# Altium schematic sheet HCRT_STM32_Sch.SchDoc
size A4
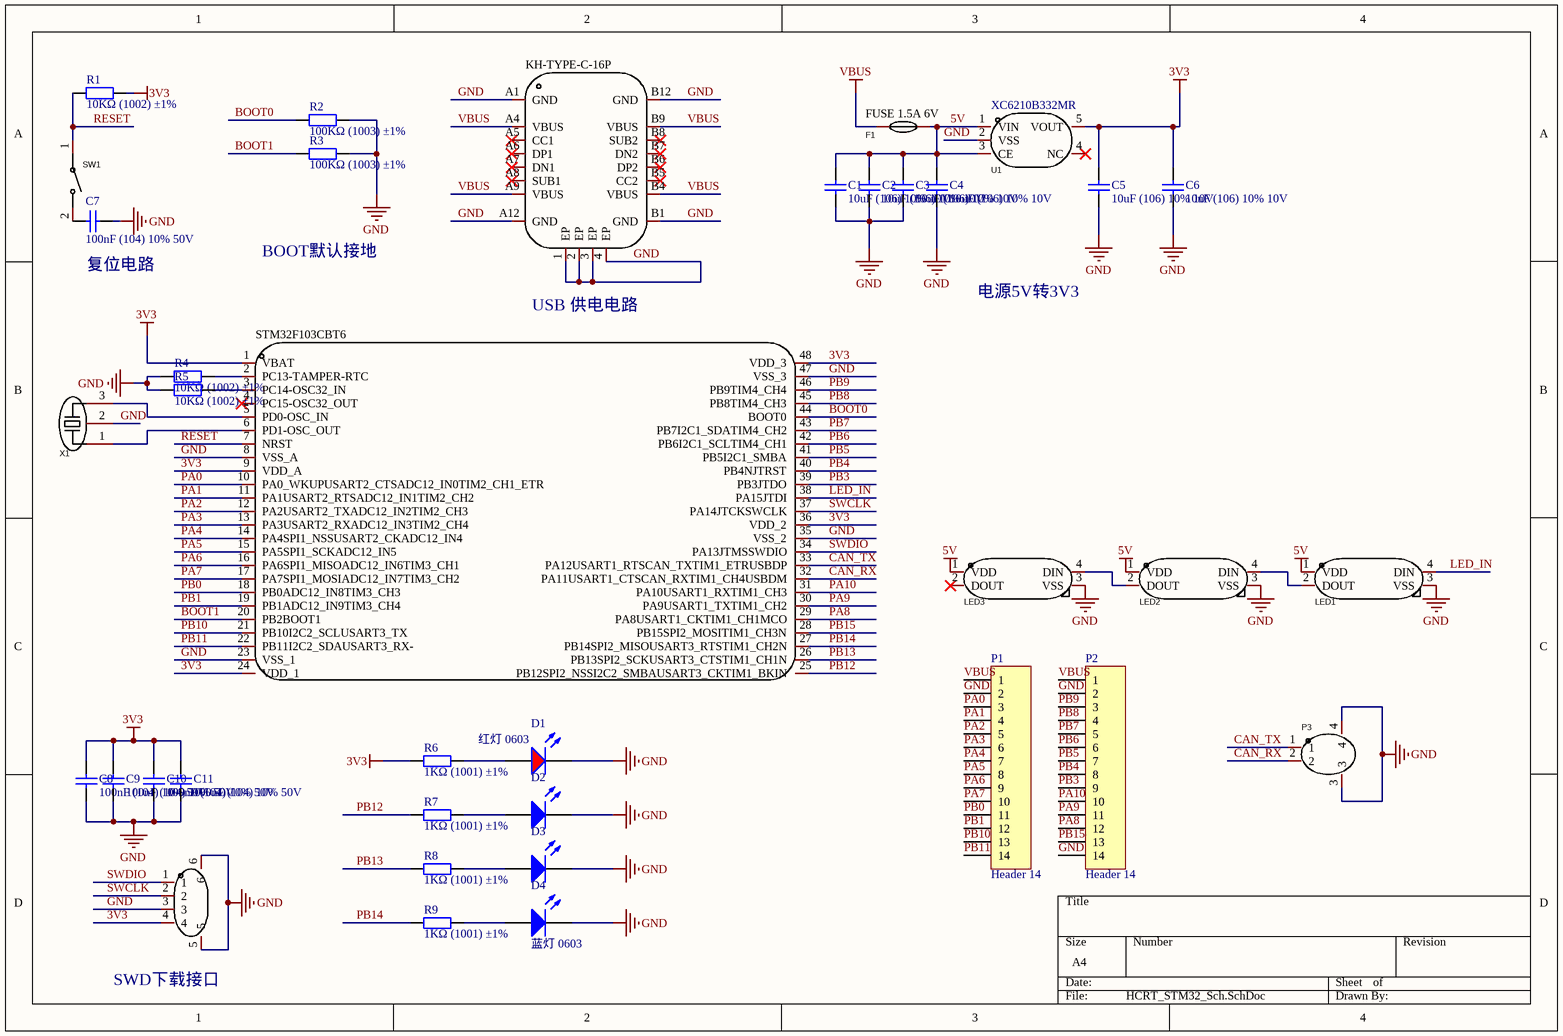
[diagram p0: HCRT_STM32_Sch.SchDoc]

## Parts
C1  10uF (106) 10% 10V  [0603_C]
C2  10uF (106) 10% 10V  [0603_C]
C3  10uF (106) 10% 10V  [0603_C]
C4  10uF (106) 10% 10V  [0603_C]
C5  10uF (106) 10% 10V  [0603_C]
C6  10uF (106) 10% 10V  [0603_C]
C7  100nF (104) 10% 50V  [0603_C]
C8  100nF (104) 10% 50V  [0603_C]
C9  100nF (104) 10% 50V  [0603_C]
C10  100nF (104) 10% 50V  [0603_C]
C11  100nF (104) 10% 50V  [0603_C]
CN1  HC-1.25-4PWT  [CONN-SMD_4P-P1.25-HC-1.25-4PWT]  (value not drawn)
D1  红灯 0603  [0603_LED_S1]
D2  蓝灯 0603  [0603_LED_S1]  (value not drawn)
D3  蓝灯 0603  [0603_LED_S1]  (value not drawn)
D4  蓝灯 0603  [0603_LED_S1]
F1  FUSE0603  [F0603]  (value not drawn)
LED1  WS2812C  [LED-SMD_4P-L5.0-W5.0-LS5.4-TL-1]  (value not drawn)
LED2  WS2812C  [LED-SMD_4P-L5.0-W5.0-LS5.4-TL-1]  (value not drawn)
LED3  WS2812C  [LED-SMD_4P-L5.0-W5.0-LS5.4-TL-1]  (value not drawn)
P1  Header 14  [HDR1X14]
P2  Header 14  [HDR1X14]
P3  1.25_2P  [CONN-SMD_SM02B-GHS-TB-LF-SN]  (value not drawn)
R1  10KΩ (1002) ±1%  [0603_R]
R2  100KΩ (1003) ±1%  [0603_R]
R3  100KΩ (1003) ±1%  [0603_R]
R4  10KΩ (1002) ±1%  [0603_R]
R5  10KΩ (1002) ±1%  [0603_R]
R6  1KΩ (1001) ±1%  [0603_R]
R7  1KΩ (1001) ±1%  [0603_R]
R8  1KΩ (1001) ±1%  [0603_R]
R9  1KΩ (1001) ±1%  [0603_R]
SW1  K2-1107ST-A4DW-06_C118141  [KEY-SMD_L6.2-W3.6-LS8.0]  (value not drawn)
U1  XC6210B332MR  [SOT-23-5_L3.0-W1.7-P0.95-LS2.8-BR]
U2  STM32F103CBT6  [LQFP-48_L7.0-W7.0-P0.50-LS9.0-BL]  (value not drawn)
USB1  KH-TYPE-C-16P  [USB-C-SMD_KH-TYPE-C-16P]  (value not drawn)
X1  CSTCE8M00G15C99-R0  [OSC-SMD_3P-L3.2-W1.3-P1.2-L]  (value not drawn)

## Nets
3V3: C5.2 C6.2 C8.2 C9.2 C10.2 C11.2 CN1.4 R1.2 R6.1 U1.5(VOUT) U2.1(VBAT) U2.9(VDD_A) U2.24(VDD_1) U2.36(VDD_2) U2.48(VDD_3)
5V: C1.2 C2.2 C3.2 C4.2 F1.2 LED1.1(VDD) LED2.1(VDD) LED3.1(VDD) U1.1(VIN) U1.3(CE)
GND: C1.1 C2.1 C3.1 C4.1 C5.1 C6.1 C7.2 C8.1 C9.1 C10.1 C11.1 CN1.3 CN1.5 CN1.6 D1.K D2.K D3.K D4.K LED1.3(VSS) LED2.3(VSS) LED3.3(VSS) P1.2 P2.2 P2.14 P3.3 P3.4 R2.2 R3.2 R4.1 R5.1 U1.2(VSS) U2.8(VSS_A) U2.23(VSS_1) U2.35(VSS_2) U2.47(VSS_3) USB1.1(EP) USB1.2(EP) USB1.3(EP) USB1.4(EP) USB1.A1(GND) USB1.A12(GND) USB1.B1(GND) USB1.B12(GND) X1.2
VBUS: F1.1 P1.1 P2.1 USB1.A4(VBUS) USB1.A9(VBUS) USB1.B4(VBUS) USB1.B9(VBUS)
BOOT0: R2.1 U2.44(BOOT0)
BOOT1: R3.1 U2.20(PB2BOOT1)
CAN_RX: P3.2 U2.32(PA11USART1_CTSCAN_RXTIM1_CH4USBDM)
CAN_TX: P3.1 U2.33(PA12USART1_RTSCAN_TXTIM1_ETRUSBDP)
LED_IN: LED1.4(DIN) U2.38(PA15JTDI)
PA0: P1.3 U2.10(PA0_WKUPUSART2_CTSADC12_IN0TIM2_CH1_ETR)
PA1: P1.4 U2.11(PA1USART2_RTSADC12_IN1TIM2_CH2)
PA2: P1.5 U2.12(PA2USART2_TXADC12_IN2TIM2_CH3)
PA3: P1.6 U2.13(PA3USART2_RXADC12_IN3TIM2_CH4)
PA4: P1.7 U2.14(PA4SPI1_NSSUSART2_CKADC12_IN4)
PA5: P1.8 U2.15(PA5SPI1_SCKADC12_IN5)
PA6: P1.9 U2.16(PA6SPI1_MISOADC12_IN6TIM3_CH1)
PA7: P1.10 U2.17(PA7SPI1_MOSIADC12_IN7TIM3_CH2)
PA8: P2.12 U2.29(PA8USART1_CKTIM1_CH1MCO)
PA9: P2.11 U2.30(PA9USART1_TXTIM1_CH2)
PA10: P2.10 U2.31(PA10USART1_RXTIM1_CH3)
PB0: P1.11 U2.18(PB0ADC12_IN8TIM3_CH3)
PB1: P1.12 U2.19(PB1ADC12_IN9TIM3_CH4)
PB3: P2.9 U2.39(PB3JTDO)
PB4: P2.8 U2.40(PB4NJTRST)
PB5: P2.7 U2.41(PB5I2C1_SMBA)
PB6: P2.6 U2.42(PB6I2C1_SCLTIM4_CH1)
PB7: P2.5 U2.43(PB7I2C1_SDATIM4_CH2)
PB8: P2.4 U2.45(PB8TIM4_CH3)
PB9: P2.3 U2.46(PB9TIM4_CH4)
PB10: P1.13 U2.21(PB10I2C2_SCLUSART3_TX)
PB11: P1.14 U2.22(PB11I2C2_SDAUSART3_RX-)
PB12: R7.1 U2.25(PB12SPI2_NSSI2C2_SMBAUSART3_CKTIM1_BKIN)
PB13: R8.1 U2.26(PB13SPI2_SCKUSART3_CTSTIM1_CH1N)
PB14: R9.1 U2.27(PB14SPI2_MISOUSART3_RTSTIM1_CH2N)
PB15: P2.13 U2.28(PB15SPI2_MOSITIM1_CH3N)
RESET: R1.1 SW1.1 U2.7(NRST)
SWCLK: CN1.2 U2.37(PA14JTCKSWCLK)
SWDIO: CN1.1 U2.34(PA13JTMSSWDIO)
NetC7_1: C7.1 SW1.2
NetD1_A: D1.A R6.2
NetD2_A: D2.A R7.2
NetD3_A: D3.A R8.2
NetD4_A: D4.A R9.2
NetLED1_2: LED1.2(DOUT) LED2.4(DIN)
NetLED2_2: LED2.2(DOUT) LED3.4(DIN)
NetR4_2: R4.2 U2.2(PC13-TAMPER-RTC)
NetR5_2: R5.2 U2.3(PC14-OSC32_IN)
NetU2_5: U2.5(PD0-OSC_IN) X1.3
NetU2_6: U2.6(PD1-OSC_OUT) X1.1

Not connected (* = marked no-connect by the designer): LED3 2(DOUT)*; U1 4(NC)*; U2 4(PC15-OSC32_OUT)*; USB1 A5(CC1)* A6(DP1)* A7(DN1)* A8(SUB1)* B5(CC2)* B6(DP2)* B7(DN2)* B8(SUB2)*

## Notes on the sheet
- 复位电路
- BOOT默认接地
- USB 供电电路
- 电源5V转3V3
- (near CN1) SWD下载接口
- (in symbol FUSE0603) FUSE 1.5A 6V

## Library data of the parts
C1-C6 = 0603 10uF (106) 10% 10V: 贴片电容; ComponentLink1Description: 供应商链接; ComponentLink1URL: http://www.szlcsc.com/product/details_20411.html; Package: 0603; Supplier: LC; SuppliersPartNumber: C19702
C7-C11 = 0603 100nF (104) 10% 50V: 贴片电容; ComponentLink1Description: 供应商链接; ComponentLink1URL: http://www.szlcsc.com/product/details_15331.html; Package: 0603; Supplier: LC; SuppliersPartNumber: C14663
CN1 = HC-1.25-4PWT: Manufacturer: HCTL(华灿天禄); Add into BOM: yes; Pitch: 1.25mm; Pins Structure: 1x4P; Number of PINs Per Row: 4; Gender: 公型插针; Current Rating (Max): 1A; Name: HC-1.25-4PWT; Symbol: HC-1.25-4PWT; Device: HC-1.25-4PWT; LCSC Part Name: 4P 卧贴 间距P=1.25mm; Supplier Part: C2845381; Manufacturer Part: HC-1.25-4PWT; Supplier Footprint: SMD,P=1.25mm; JLCPCB Part Class: Extended Part; Datasheet: https://atta.szlcsc.com/upload/public/pdf/source/20210728/C2845379_48B7DC28A4B35DB030A7253F7C3FD974.pdf; Supplier: LCSC; Convert to PCB: yes; Reference Series: -; Number of Rows: 1; Row Spacing: -; Mounting Style: 卧贴; Operating Temperature Range: -25℃~+85℃
D1 = 0603 红灯: 发光二极管; ComponentLink1Description: 供应商链接; ComponentLink1URL: http://www.szlcsc.com/product/details_2659.html; Package: 0603; Supplier: LC; SuppliersPartNumber: C2286
D2-D4 = 0603 蓝灯: 发光二极管; ComponentLink1Description: 供应商链接; ComponentLink1URL: http://www.szlcsc.com/product/details_73150.html; Package: 0603; Supplier: LC; SuppliersPartNumber: C72041
F1 = FUSE0603: Manufacturer: BHFUSE(佰宏); Name: BSMD0603L-150; Add into BOM: yes; Operating Voltage (Max): 6V; Hold Current: 1.5A; Current Rating (Max): 50A; Power Dissipation: 1W; Trip Current: 3A; Resistance - Initial (Ri) (Min): 5mΩ; Maximum Time to Trip: 500ms; Resistance - Post Trip (R1) (Max): 55mΩ; Symbol: BSMD0603L-150; Device: BSMD0603L-150; LCSC Part Name: 0603 1.5A 6V; Supplier Part: C914094; Manufacturer Part: BSMD0603L-150; Supplier Footprint: 0603; JLCPCB Part Class: Extended Part; Datasheet: https://atta.szlcsc.com/upload/public/pdf/source/20210323/C914094_E2A7202F3A3191041F4CBB065BB19E4A.pdf; Supplier: LCSC; Convert to PCB: yes; Operating Temperature: -40℃~+85℃
LED1-LED3 = WS2812C: Manufacturer: worldsemi; Add into BOM: yes; Emitted Color: RGB三色; Name: WS2812C; Symbol: WS2812C; Device: WS2812C; LCSC Part Name: RGB三色 （注意防潮，请查阅规格书中对应具体内容）; Supplier Part: C114587; Manufacturer Part: WS2812C; Supplier Footprint: 5050(mm); JLCPCB Part Class: Extended Part; Datasheet: https://atta.szlcsc.com/upload/public/pdf/source/20171019/C114587_15083980074721044737.pdf; Supplier: LCSC; Convert to PCB: yes
P1 P2 = Header 14: Header, 14-Pin; LatestRevisionDate: 17-Jul-2002; LatestRevisionNote: Re-released for DXP Platform.; Publisher: Altium Limited
P3 = 1.25_2P: Manufacturer: JST; Name: SM02B-GHS-TB(LF)(SN); Add into BOM: yes; Reference Series: GH; Pitch: 1.25mm; Pins Structure: 1x2P; Number of PINs Per Row: 2; Symbol: SM02B-GHS-TB(LF)(SN); Device: SM02B-GHS-TB(LF)(SN); LCSC Part Name: GH系列 插座 1*2P 间距1.25mm 贴片; Supplier Part: C189893; Manufacturer Part: SM02B-GHS-TB(LF)(SN); Supplier Footprint: SMD,P=1.25mm; JLCPCB Part Class: Extended Part; Datasheet: https://atta.szlcsc.com/upload/public/pdf/source/20180327/C189893_080A21CBA32DEDB99FCCE389533BAAB8.pdf; Supplier: LCSC; Convert to PCB: yes; Number of Rows: 1; Row Spacing: -; Mounting Style: -; Contact Material: 磷青铜
R1 R4 R5 = 0603 10KΩ (1002) 1%: 贴片电阻; ComponentLink1Description: 供应商链接; ComponentLink1URL: http://www.szlcsc.com/product/details_26547.html; Package: 0603; Supplier: LC; SuppliersPartNumber: C25804
R2 R3 = 0603 100KΩ (1003) 1%: 贴片电阻; ComponentLink1Description: 供应商链接; ComponentLink1URL: http://www.szlcsc.com/product/details_26546.html; Package: 0603; Supplier: LC; SuppliersPartNumber: C25803
R6-R9 = 0603 1KΩ (1001) 1%: 贴片电阻; ComponentLink1Description: 供应商链接; ComponentLink1URL: http://www.szlcsc.com/product/details_21904.html; Package: 0603; Supplier: LC; SuppliersPartNumber: C21190
SW1 = K2-1107ST-A4DW-06_C118141: Manufacturer: 韩国韩荣; Symbol: K2-1107ST-A4SW-06; Add into BOM: yes; Contact Current: 50mA; Voltage Rating (DC): 12V; Insulation Resistance: 100MΩ; Circuit: 单刀单掷; Actuator Style: 矩形按钮; Operating Force: 250gf@±30gf; Mechanical Life: 100000; Switch Length: 6.1mm; Switch Width: 3.6mm; Switch Height: 2.5mm; Name: K2-1107ST-A4DW-06; Device: K2-1107ST-A4DW-06_C118141; LCSC Part Name: 轻触开关 3.6*6.1*2.5; Supplier Part: C118141; Manufacturer Part: K2-1107ST-A4DW-06; Supplier Footprint: SMD; JLCPCB Part Class: Extended Part; Datasheet: https://atta.szlcsc.com/upload/public/pdf/source/20210810/381712CEF248770C072B585C3485C888.pdf; Supplier: LCSC; Convert to PCB: yes; Mounting Style: 立贴; With Lamp: -; Operating Temperature: -25℃~+85℃
U1 = XC6210B332MR: Manufacturer: TOREX(特瑞仕); Symbol: XC6210B332MR_C424705; Add into BOM: yes; Output Type: 固定; Output Polarity: 正; Number of Outputs: 1; Maximum Input Voltage: 6V; Output Voltage: 3.3V; Dropout Voltage: 75mV@(100mA); Output Current: 900mA; Power Supply Rejection Ratio (PRSS): 60dB@(1kHz); Name: XC6210B332MR; Device: XC6210B332MR_C424705; LCSC Part Name: Vin=6V Vout=3.3V 900mA 60dB@(1kHz); Supplier Part: C424705; Manufacturer Part: XC6210B332MR; Supplier Footprint: SOT-25; JLCPCB Part Class: Extended Part; Datasheet: https://atta.szlcsc.com/upload/public/pdf/source/20190903/C424705_1DFB2113A9A78D399905DBF688657204.pdf; Supplier: LCSC; Convert to PCB: yes
U2 = STM32F103CBT6: Manufacturer: ST(意法半导体); Add into BOM: yes; Speed: 72MHz; Voltage - Supply (Vcc/Vdd): 2V ~ 3.6V; RAM Size: 20KB; Number of I/O: 37; A/D: 16x12bit; PWM: 13; UART/USART: 3 USART; I2C（SMBUS/PMBUS）: 2; USB Device: 1; Name: STM32F103CBT6; Symbol: STM32F103CBT6; Device: STM32F103CBT6; LCSC Part Name: STM32F103CBT6; Supplier Part: C8304; Manufacturer Part: STM32F103CBT6; Supplier Footprint: LQFP-48_7x7x05P; JLCPCB Part Class: Extended Part; Datasheet: https://atta.szlcsc.com/upload/public/pdf/source/20140724/1457707170379.pdf; Supplier: LCSC; Convert to PCB: yes; CAN: 1
USB1 = KH-TYPE-C-16P: Manufacturer: kinghelm(金航标); Add into BOM: yes; Connector Type: Type-C; Gender: 母座; Number of Contacts: 16; Number of Ports: 1; Current Rating - Power (Max): 3A; Name: KH-TYPE-C-16P; Symbol: KH-TYPE-C-16P; Device: KH-TYPE-C-16P; LCSC Part Name: Type-C 母座 卧贴; Supplier Part: C709357; Manufacturer Part: KH-TYPE-C-16P; Supplier Footprint: SMD; JLCPCB Part Class: Extended Part; Datasheet: https://atta.szlcsc.com/upload/public/pdf/source/20200911/C709357_AA8DCEB38BB20E3035A7ED7AE7667837.pdf; Supplier: LCSC; Convert to PCB: yes; Standard: -; Mounting Style: 卧贴; Operating Temperature Range: -40℃~+85℃
X1 = CSTCE8M00G15C99-R0: Manufacturer: muRata(村田); Name: 8MHz; Add into BOM: yes; Value: 8MHz; Frequency Stability: ±0.13%; Frequency Tolerance: ±0.1%; Built-in Load Capacitance: 33pF; Resonant Impedance: 40Ω; Symbol: CSTCE8M00G15C99-R0; Device: CSTCE8M00G15C99-R0; LCSC Part Name: 8M ±0.1% 33pF; Supplier Part: C110614; Manufacturer Part: CSTCE8M00G15C99-R0; Supplier Footprint: SMD3213-3P; JLCPCB Part Class: Extended Part; Datasheet: https://atta.szlcsc.com/upload/public/pdf/source/20180327/C110614_9F5031E08ADB10DE4472527BF78A8CAF.pdf; Supplier: LCSC; Convert to PCB: yes; Operating Temperature: -40℃~+125℃